# EAGLE schematic kingoftone_v2 (EAGLE 6.4)
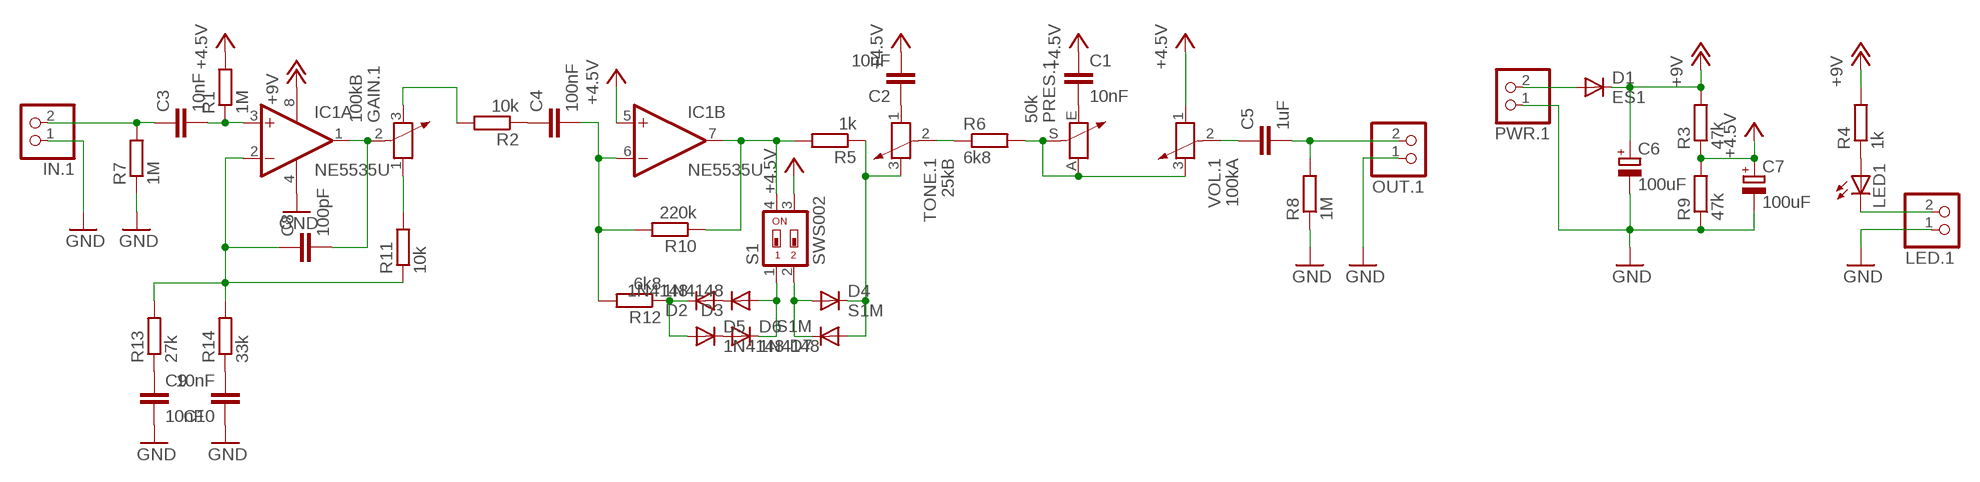
[diagram p0: schematic, sheet 1]

## Parts
C1  10nF  C-EUC0805K  [C0805K]
C2  10nF  C-EUC0805K  [C0805K]
C3  10nF  C-EUC0805K  [C0805K]
C4  100nF  C-EUC0805K  [C0805K]
C5  1uF  C-EUC0805K  [C0805K]
C6  100uF  CPOL-EUD  [PANASONIC_D]
C7  100uF  CPOL-EUD  [PANASONIC_D]
C8  100pF  C-EUC0805K  [C0805K]
C9  10nF  C-EUC0805K  [C0805K]
C10  10nF  C-EUC0805K  [C0805K]
D1  ES1  [DO-214AC]
D2  1N4148  [D0805]
D3  1N4148  [D0805]
D4  S1M  [DO-214AC]
D5  1N4148  [D0805]
D6  1N4148  [D0805]
D7  S1M  [DO-214AC]
GAIN.1  100kB  POTENTIOMETER_  [1X03]
IC1  NE5535U  [SO08]
IN.1  PINHD-1X2  [1X02]
LED1  LED3MM  [LED3MM]
LED.1  PINHD-1X2  [1X02]
OUT.1  PINHD-1X2  [1X02]
PRES.1  50k  POTENTIOMETER_CT6  [CT6]
PWR.1  PINHD-1X2  [1X02]
R1  1M  R-EU_0805  [R0805]
R2  10k  R-EU_0805  [R0805]
R3  47k  R-EU_0805  [R0805]
R4  1k  R-EU_0805  [R0805]
R5  1k  R-EU_0805  [R0805]
R6  6k8  R-EU_0805  [R0805]
R7  1M  R-EU_0805  [R0805]
R8  1M  R-EU_0805  [R0805]
R9  47k  R-EU_0805  [R0805]
R10  220k  R-EU_0805  [R0805]
R11  10k  R-EU_0805  [R0805]
R12  6k8  R-EU_0805  [R0805]
R13  27k  R-EU_0805  [R0805]
R14  33k  R-EU_0805  [R0805]
S1  SWS002  [SMS-002]
TONE.1  25kB  POTENTIOMETER_  [1X03]
VOL.1  100kA  POTENTIOMETER_  [1X03]

## Nets
+4.5V: C1.1 C2.2 C7.+ IC1.5(B:+IN) R1.2 R3.1 R9.2 S1.3 VOL.1.1
+9V: C6.+ D1.C IC1.8(A:V+) R3.2 R4.2
GND: C6.- C7.- C9.2 C10.1 IC1.4(A:V-) IN.1.1 LED.1.1 OUT.1.1 PWR.1.1 R7.1 R8.1 R9.1
N$1: C3.1 IN.1.2 R7.2
N$2: C3.2 IC1.3(A:+IN) R1.1
N$3: C8.1 IC1.2(A:-IN) R11.1 R13.2 R14.2
N$4: C8.2 GAIN.1.2 IC1.1(A:OUT)
N$5: C9.1 R13.1
N$6: C10.2 R14.1
N$7: GAIN.1.1 R11.2
N$8: C4.1 R2.1
N$9: GAIN.1.3 R2.2
N$10: C4.2 IC1.6(B:-IN) R10.2 R12.2
N$11: IC1.7(B:OUT) R5.2 R10.1 S1.4
N$12: D2.A D3.K(C)
N$13: D2.K(C) D5.A R12.1
N$14: D5.K(C) D6.A
N$15: D3.A D6.K(C) S1.1
N$16: D4.C D7.A R5.1 TONE.1.3
N$17: D4.A D7.C S1.2
N$18: C5.1 VOL.1.2
N$19: R6.1 TONE.1.2
N$20: C2.1 TONE.1.1
N$21: C1.2 PRES.1.E
N$22: PRES.1.A PRES.1.S R6.2 VOL.1.3
N$23: C5.2 OUT.1.2 R8.2
N$24: D1.A PWR.1.2
N$25: LED1.A R4.1
N$26: LED1.K(C) LED.1.2

## Library data of the parts
C1-C5 C8-C10 = kingoftone:C-EU: CAPACITOR, European symbol
C6 C7 = kingoftone:CPOL-EU: POLARIZED CAPACITOR, European symbol
D1 = kingoftone:ES1
D2 D3 D5 D6 = kingoftone:1N4148: DIODE general purpose rectifier, 1 A
D4 D7 = kingoftone:S1M
GAIN.1 PRES.1 TONE.1 VOL.1 = kingoftone:POTENTIOMETER_: Potentiometer
IC1 = kingoftone:NE5535: Dual Operational Amplifier Low Power, Single-Supply, Rail-To-Rail Operational Amplifier Source: http://focus.ti.com/lit/ds/symlink/opa2345.pdf http://focus.ti.com .. opa241.pdf http://focus.ti.com/lit/ds/symlink/opa2134.pdf
IN.1 LED.1 OUT.1 PWR.1 = kingoftone:PINHD-1X2: PIN HEADER
LED1 = kingoftone:LED
R1-R14 = kingoftone:R-EU_: RESISTOR, European symbol
S1 = kingoftone:SWS002: SMD Dip Switch 2 pol.